# Altium schematic sheet Estimador_Formas-de-onda.SchDoc
size A4
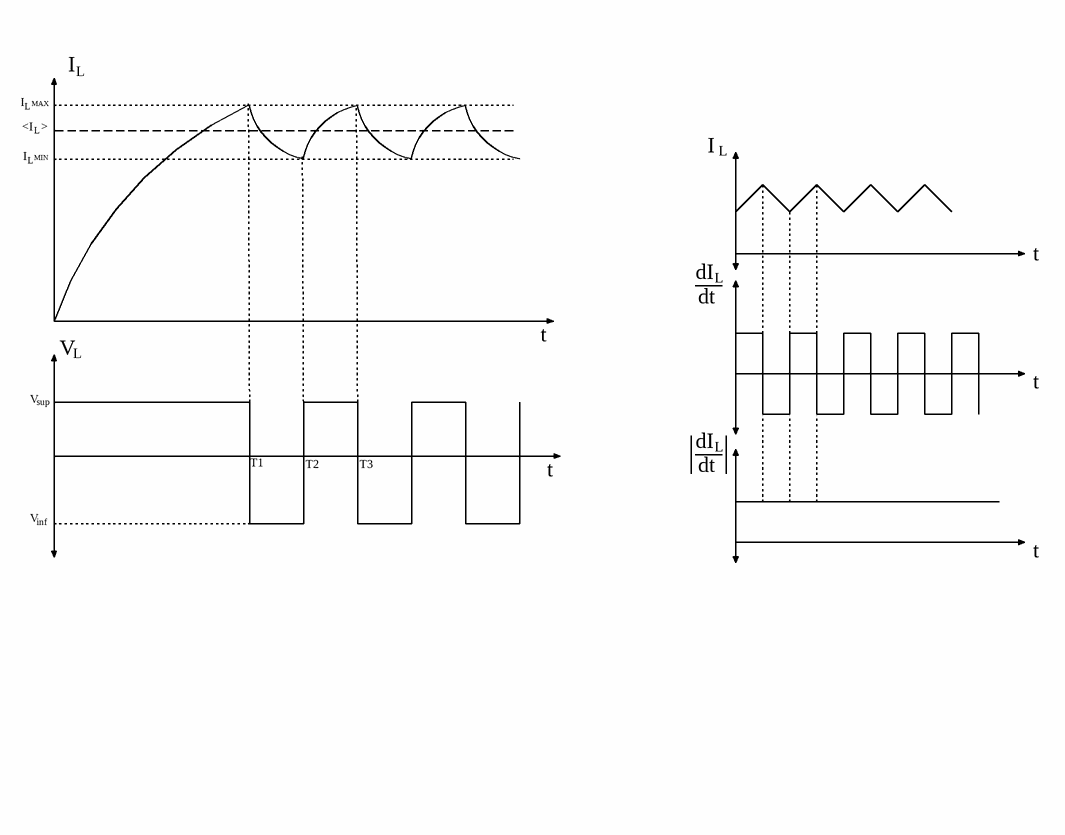
[diagram p0: Estimador_Formas-de-onda.SchDoc]

## Notes on the sheet
- I
- MAX
- L
- <I
- MIN
- >
- dI
- dt
- t
- V
- sup
- T1
- T2
- T3
- inf